# Altium project Dekor Natal.PrjPcb
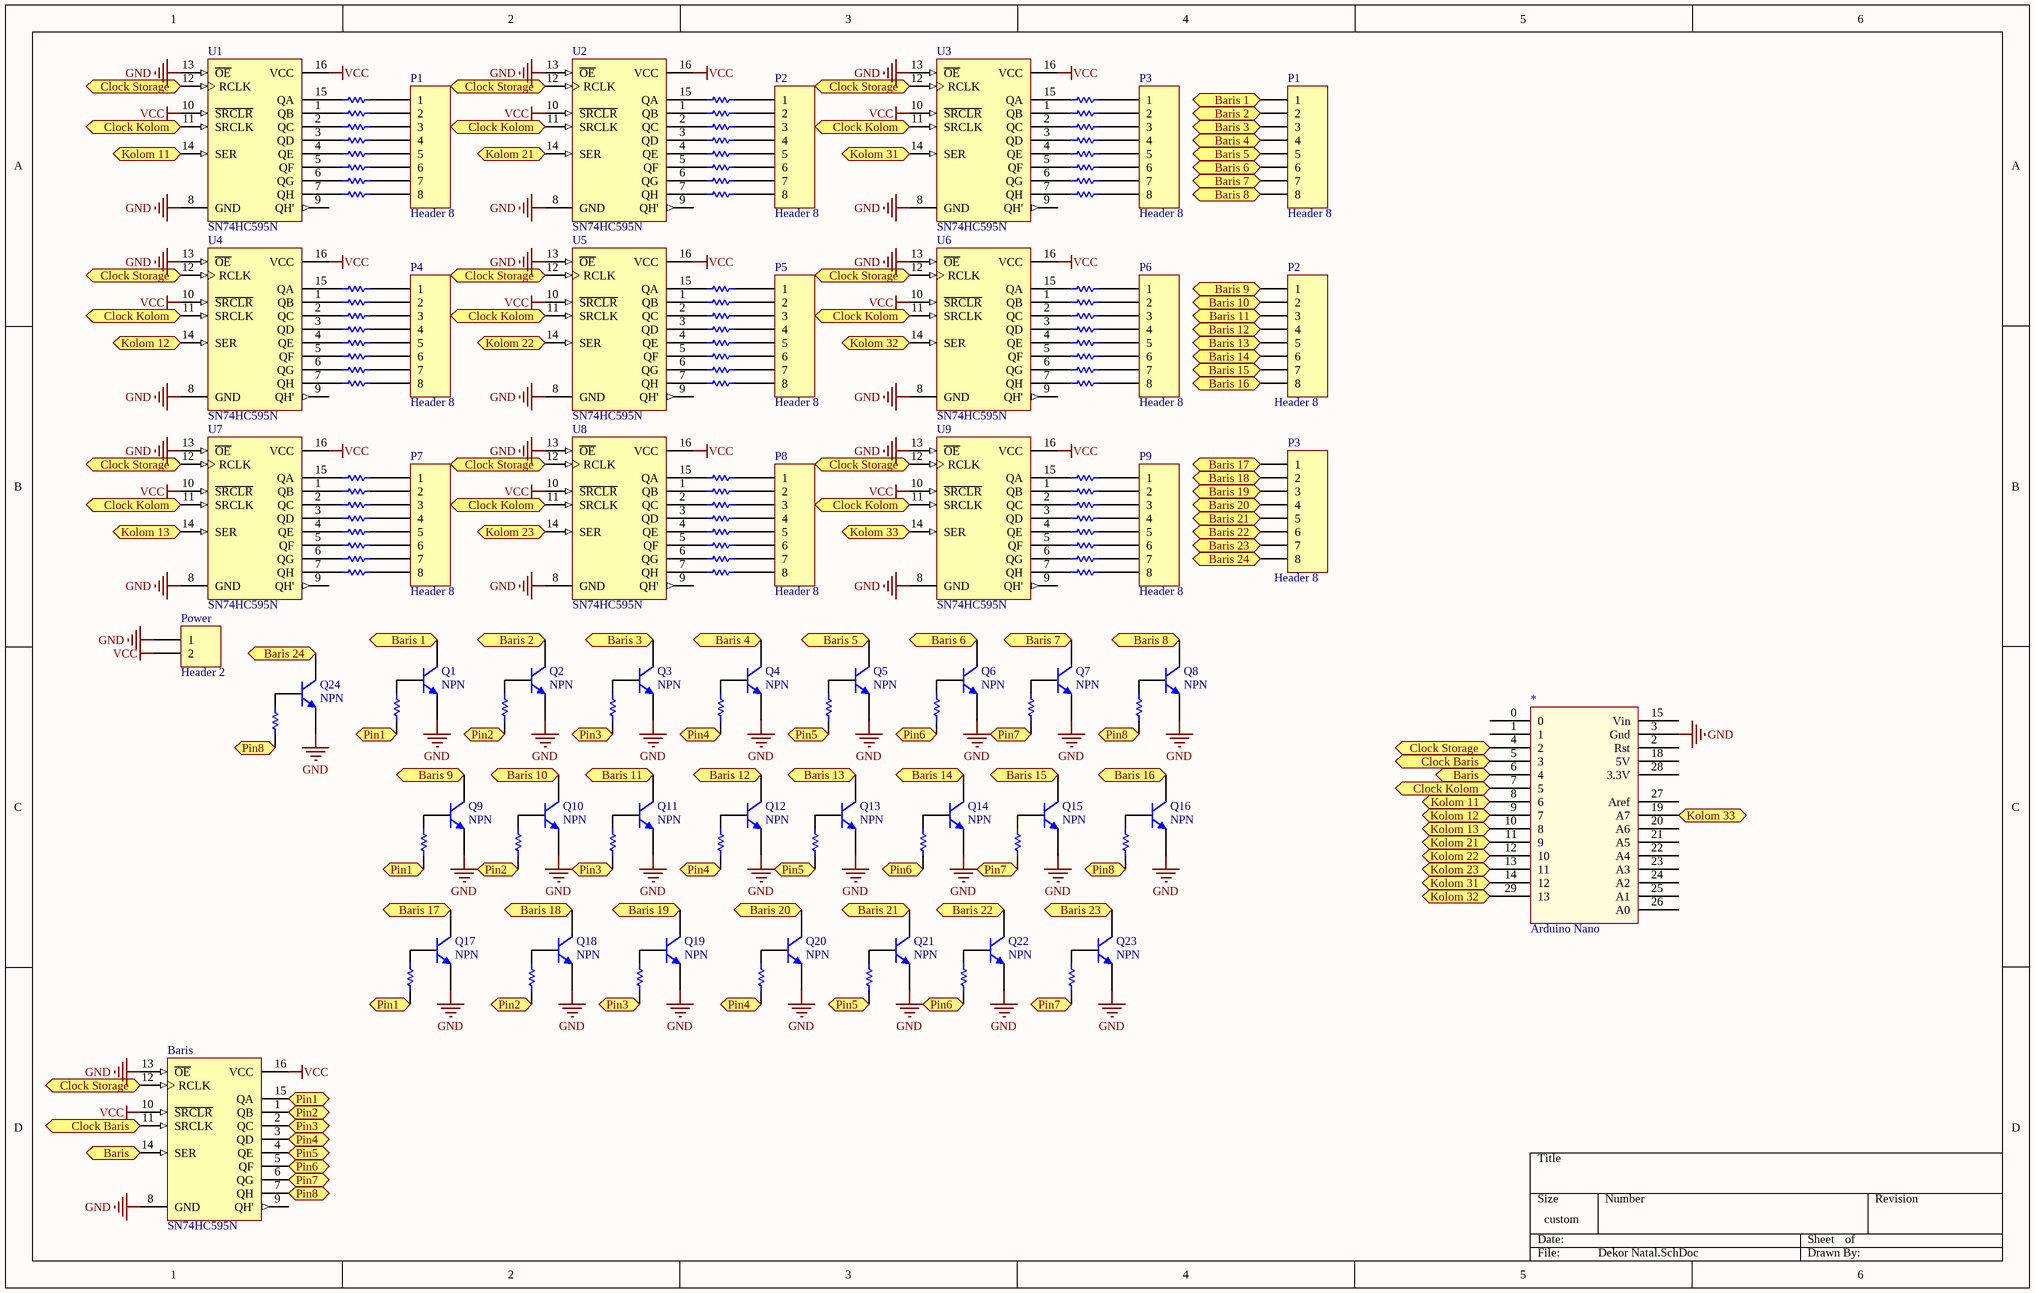
[diagram p0: Dekor Natal.SchDoc]
1 sheet, 144 parts. Net scope: flat (ports and power ports of the same name join across sheets).
Board file: Dekor Natal.PcbDoc

## Sheet Dekor Natal.SchDoc
size 381 x 241 mm; PageSetup: Record=PageOptions|CenterHorizontal=True|CenterVertical=True|PrintScale=1.00|XCorrection=1.00|YCorrection=1.00|PrintKind=1|BorderSize=5000000|LeftOffset=0|BottomOffset=0|Orientation=2|PaperLength=1000|PaperWidth=1000|Scale=100|PaperSource=7|PrintQuality=-4|MediaType=1|DitherType=10|PaperKind=A4 210x297mm|PrintScaleMode=1

### Parts
(Parts that share a designator on the sheet are numbered #1, #2 ... from top to bottom, then left to right.)
*  Arduino Nano  [Arduino Nano]
B1  Res0  [AXIAL-0.3]  (value not drawn)
B2  Res0  [AXIAL-0.3]  (value not drawn)
B3  Res0  [AXIAL-0.3]  (value not drawn)
B4  Res0  [AXIAL-0.3]  (value not drawn)
B5  Res0  [AXIAL-0.3]  (value not drawn)
B6  Res0  [AXIAL-0.3]  (value not drawn)
B7  Res0  [AXIAL-0.3]  (value not drawn)
B8  Res0  [AXIAL-0.3]  (value not drawn)
B9  Res0  [AXIAL-0.3]  (value not drawn)
B10  Res0  [AXIAL-0.3]  (value not drawn)
B11  Res0  [AXIAL-0.3]  (value not drawn)
B12  Res0  [AXIAL-0.3]  (value not drawn)
B13  Res0  [AXIAL-0.3]  (value not drawn)
B14  Res0  [AXIAL-0.3]  (value not drawn)
B15  Res0  [AXIAL-0.3]  (value not drawn)
B16  Res0  [AXIAL-0.3]  (value not drawn)
B17  Res0  [AXIAL-0.3]  (value not drawn)
B18  Res0  [AXIAL-0.3]  (value not drawn)
B19  Res0  [AXIAL-0.3]  (value not drawn)
B20  Res0  [AXIAL-0.3]  (value not drawn)
B21  Res0  [AXIAL-0.3]  (value not drawn)
B22  Res0  [AXIAL-0.3]  (value not drawn)
B23  Res0  [AXIAL-0.3]  (value not drawn)
B24  Res0  [AXIAL-0.3]  (value not drawn)
Baris  SN74HC595N  [N016]
P1#1  Header 8  [HDR1X8]
P1#2  Header 8  [HDR1X8]
P2#1  Header 8  [HDR1X8]
P2#2  Header 8  [HDR1X8]
P3#1  Header 8  [HDR1X8]
P3#2  Header 8  [HDR1X8]
P4  Header 8  [HDR1X8]
P5  Header 8  [HDR1X8]
P6  Header 8  [HDR1X8]
P7  Header 8  [HDR1X8]
P8  Header 8  [HDR1X8]
P9  Header 8  [HDR1X8]
Power  Header 2  [HDR1X2]
Q1  NPN  [TO-226-AA]
Q2  NPN  [TO-226-AA]
Q3  NPN  [TO-226-AA]
Q4  NPN  [TO-226-AA]
Q5  NPN  [TO-226-AA]
Q6  NPN  [TO-226-AA]
Q7  NPN  [TO-226-AA]
Q8  NPN  [TO-226-AA]
Q9  NPN  [TO-226-AA]
Q10  NPN  [TO-226-AA]
Q11  NPN  [TO-226-AA]
Q12  NPN  [TO-226-AA]
Q13  NPN  [TO-226-AA]
Q14  NPN  [TO-226-AA]
Q15  NPN  [TO-226-AA]
Q16  NPN  [TO-226-AA]
Q17  NPN  [TO-226-AA]
Q18  NPN  [TO-226-AA]
Q19  NPN  [TO-226-AA]
Q20  NPN  [TO-226-AA]
Q21  NPN  [TO-226-AA]
Q22  NPN  [TO-226-AA]
Q23  NPN  [TO-226-AA]
Q24  NPN  [TO-226-AA]
R11_1  Res0  [AXIAL-0.3]  (value not drawn)
R11_2  Res0  [AXIAL-0.3]  (value not drawn)
R11_3  Res0  [AXIAL-0.3]  (value not drawn)
R11_4  Res0  [AXIAL-0.3]  (value not drawn)
R11_5  Res0  [AXIAL-0.3]  (value not drawn)
R11_6  Res0  [AXIAL-0.3]  (value not drawn)
R11_7  Res0  [AXIAL-0.3]  (value not drawn)
R11_8  Res0  [AXIAL-0.3]  (value not drawn)
R12_1  Res0  [AXIAL-0.3]  (value not drawn)
R12_2  Res0  [AXIAL-0.3]  (value not drawn)
R12_3  Res0  [AXIAL-0.3]  (value not drawn)
R12_4  Res0  [AXIAL-0.3]  (value not drawn)
R12_5  Res0  [AXIAL-0.3]  (value not drawn)
R12_6  Res0  [AXIAL-0.3]  (value not drawn)
R12_7  Res0  [AXIAL-0.3]  (value not drawn)
R12_8  Res0  [AXIAL-0.3]  (value not drawn)
R13_1  Res0  [AXIAL-0.3]  (value not drawn)
R13_2  Res0  [AXIAL-0.3]  (value not drawn)
R13_3  Res0  [AXIAL-0.3]  (value not drawn)
R13_4  Res0  [AXIAL-0.3]  (value not drawn)
R13_5  Res0  [AXIAL-0.3]  (value not drawn)
R13_6  Res0  [AXIAL-0.3]  (value not drawn)
R13_7  Res0  [AXIAL-0.3]  (value not drawn)
R13_8  Res0  [AXIAL-0.3]  (value not drawn)
R21_1  Res0  [AXIAL-0.3]  (value not drawn)
R21_2  Res0  [AXIAL-0.3]  (value not drawn)
R21_3  Res0  [AXIAL-0.3]  (value not drawn)
R21_4  Res0  [AXIAL-0.3]  (value not drawn)
R21_5  Res0  [AXIAL-0.3]  (value not drawn)
R21_6  Res0  [AXIAL-0.3]  (value not drawn)
R21_7  Res0  [AXIAL-0.3]  (value not drawn)
R21_8  Res0  [AXIAL-0.3]  (value not drawn)
R22_1  Res0  [AXIAL-0.3]  (value not drawn)
R22_2  Res0  [AXIAL-0.3]  (value not drawn)
R22_3  Res0  [AXIAL-0.3]  (value not drawn)
R22_4  Res0  [AXIAL-0.3]  (value not drawn)
R22_5  Res0  [AXIAL-0.3]  (value not drawn)
R22_6  Res0  [AXIAL-0.3]  (value not drawn)
R22_7  Res0  [AXIAL-0.3]  (value not drawn)
R22_8  Res0  [AXIAL-0.3]  (value not drawn)
R23_1  Res0  [AXIAL-0.3]  (value not drawn)
R23_2  Res0  [AXIAL-0.3]  (value not drawn)
R23_3  Res0  [AXIAL-0.3]  (value not drawn)
R23_4  Res0  [AXIAL-0.3]  (value not drawn)
R23_5  Res0  [AXIAL-0.3]  (value not drawn)
R23_6  Res0  [AXIAL-0.3]  (value not drawn)
R23_7  Res0  [AXIAL-0.3]  (value not drawn)
R23_8  Res0  [AXIAL-0.3]  (value not drawn)
R31_1  Res0  [AXIAL-0.3]  (value not drawn)
R31_2  Res0  [AXIAL-0.3]  (value not drawn)
R31_3  Res0  [AXIAL-0.3]  (value not drawn)
R31_4  Res0  [AXIAL-0.3]  (value not drawn)
R31_5  Res0  [AXIAL-0.3]  (value not drawn)
R31_6  Res0  [AXIAL-0.3]  (value not drawn)
R31_7  Res0  [AXIAL-0.3]  (value not drawn)
R31_8  Res0  [AXIAL-0.3]  (value not drawn)
R32_1  Res0  [AXIAL-0.3]  (value not drawn)
R32_2  Res0  [AXIAL-0.3]  (value not drawn)
R32_3  Res0  [AXIAL-0.3]  (value not drawn)
R32_4  Res0  [AXIAL-0.3]  (value not drawn)
R32_5  Res0  [AXIAL-0.3]  (value not drawn)
R32_6  Res0  [AXIAL-0.3]  (value not drawn)
R32_7  Res0  [AXIAL-0.3]  (value not drawn)
R32_8  Res0  [AXIAL-0.3]  (value not drawn)
R33_1  Res0  [AXIAL-0.3]  (value not drawn)
R33_2  Res0  [AXIAL-0.3]  (value not drawn)
R33_3  Res0  [AXIAL-0.3]  (value not drawn)
R33_4  Res0  [AXIAL-0.3]  (value not drawn)
R33_5  Res0  [AXIAL-0.3]  (value not drawn)
R33_6  Res0  [AXIAL-0.3]  (value not drawn)
R33_7  Res0  [AXIAL-0.3]  (value not drawn)
R33_8  Res0  [AXIAL-0.3]  (value not drawn)
U1  SN74HC595N  [N016]
U2  SN74HC595N  [N016]
U3  SN74HC595N  [N016]
U4  SN74HC595N  [N016]
U5  SN74HC595N  [N016]
U6  SN74HC595N  [N016]
U7  SN74HC595N  [N016]
U8  SN74HC595N  [N016]
U9  SN74HC595N  [N016]

### Ports
Baris, Baris 1, Baris 2, Baris 3, Baris 4, Baris 5, Baris 6, Baris 7, Baris 8, Baris 9, Baris 10, Baris 11, Baris 12, Baris 13, Baris 14, Baris 15, Baris 16, Baris 17, Baris 18, Baris 19, Baris 20, Baris 21, Baris 22, Baris 23, Baris 24, Clock Baris, Clock Kolom, Clock Storage, Kolom 11, Kolom 12, Kolom 13, Kolom 21, Kolom 22, Kolom 23, Kolom 31, Kolom 32, Kolom 33, Pin1, Pin2, Pin3, Pin4, Pin5, Pin6, Pin7, Pin8

### Nets
GND: *.3(Gnd) Baris.8(GND) Baris.13(~{OE}) Power.1 Q1.3(E) Q2.3(E) Q3.3(E) Q4.3(E) Q5.3(E) Q6.3(E) Q7.3(E) Q8.3(E) Q9.3(E) Q10.3(E) Q11.3(E) Q12.3(E) Q13.3(E) Q14.3(E) Q15.3(E) Q16.3(E) Q17.3(E) Q18.3(E) Q19.3(E) Q20.3(E) Q21.3(E) Q22.3(E) Q23.3(E) Q24.3(E) U1.8(GND) U1.13(~{OE}) U2.8(GND) U2.13(~{OE}) U3.8(GND) U3.13(~{OE}) U4.8(GND) U4.13(~{OE}) U5.8(GND) U5.13(~{OE}) U6.8(GND) U6.13(~{OE}) U7.8(GND) U7.13(~{OE}) U8.8(GND) U8.13(~{OE}) U9.8(GND) U9.13(~{OE})
VCC: Baris.10(~{SRCLR}) Baris.16(VCC) Power.2 U1.10(~{SRCLR}) U1.16(VCC) U2.10(~{SRCLR}) U2.16(VCC) U3.10(~{SRCLR}) U3.16(VCC) U4.10(~{SRCLR}) U4.16(VCC) U5.10(~{SRCLR}) U5.16(VCC) U6.10(~{SRCLR}) U6.16(VCC) U7.10(~{SRCLR}) U7.16(VCC) U8.10(~{SRCLR}) U8.16(VCC) U9.10(~{SRCLR}) U9.16(VCC)
Net*_4: *.4(2) Baris.12(RCLK) U1.12(RCLK) U2.12(RCLK) U3.12(RCLK) U4.12(RCLK) U5.12(RCLK) U6.12(RCLK) U7.12(RCLK) U8.12(RCLK) U9.12(RCLK) ; port Clock Storage
Net*_5: *.5(3) Baris.11(SRCLK) ; port Clock Baris
Net*_6: *.6(4) Baris.14(SER) ; port Baris
Net*_7: *.7(5) U1.11(SRCLK) U2.11(SRCLK) U3.11(SRCLK) U4.11(SRCLK) U5.11(SRCLK) U6.11(SRCLK) U7.11(SRCLK) U8.11(SRCLK) U9.11(SRCLK) ; port Clock Kolom
Net*_8: *.8(6) U1.14(SER) ; port Kolom 11
Net*_9: *.9(7) U4.14(SER) ; port Kolom 12
Net*_10: *.10(8) U7.14(SER) ; port Kolom 13
Net*_11: *.11(9) U2.14(SER) ; port Kolom 21
Net*_12: *.12(10) U5.14(SER) ; port Kolom 22
Net*_13: *.13(11) U8.14(SER) ; port Kolom 23
Net*_14: *.14(12) U3.14(SER) ; port Kolom 31
Net*_19: *.19(A7) U9.14(SER) ; port Kolom 33
Net*_29: *.29(13) U6.14(SER) ; port Kolom 32
NetB1_1: B1.1 B9.1 B17.1 Baris.15(QA) ; port Pin1
NetB1_2: B1.2 Q1.2(B)
NetB2_1: B2.1 B10.1 B18.1 Baris.1(QB) ; port Pin2
NetB2_2: B2.2 Q2.2(B)
NetB3_1: B3.1 B11.1 B19.1 Baris.2(QC) ; port Pin3
NetB3_2: B3.2 Q3.2(B)
NetB4_1: B4.1 B12.1 B20.1 Baris.3(QD) ; port Pin4
NetB4_2: B4.2 Q4.2(B)
NetB5_1: B5.1 B13.1 B21.1 Baris.4(QE) ; port Pin5
NetB5_2: B5.2 Q5.2(B)
NetB6_1: B6.1 B14.1 B22.1 Baris.5(QF) ; port Pin6
NetB6_2: B6.2 Q6.2(B)
NetB7_1: B7.1 B15.1 B23.1 Baris.6(QG) ; port Pin7
NetB7_2: B7.2 Q7.2(B)
NetB8_1: B8.1 B16.1 B24.1 Baris.7(QH) ; port Pin8
NetB8_2: B8.2 Q8.2(B)
NetB9_2: B9.2 Q9.2(B)
NetB10_2: B10.2 Q10.2(B)
NetB11_2: B11.2 Q11.2(B)
NetB12_2: B12.2 Q12.2(B)
NetB13_2: B13.2 Q13.2(B)
NetB14_2: B14.2 Q14.2(B)
NetB15_2: B15.2 Q15.2(B)
NetB16_2: B16.2 Q16.2(B)
NetB17_2: B17.2 Q17.2(B)
NetB18_2: B18.2 Q18.2(B)
NetB19_2: B19.2 Q19.2(B)
NetB20_2: B20.2 Q20.2(B)
NetB21_2: B21.2 Q21.2(B)
NetB22_2: B22.2 Q22.2(B)
NetB23_2: B23.2 Q23.2(B)
NetB24_2: B24.2 Q24.2(B)
NetP1#1_1: P1#1.1 R11_1.2
NetP1#1_2: P1#1.2 R11_2.2
NetP1#1_3: P1#1.3 R11_3.2
NetP1#1_4: P1#1.4 R11_4.2
NetP1#1_5: P1#1.5 R11_5.2
NetP1#1_6: P1#1.6 R11_6.2
NetP1#1_7: P1#1.7 R11_7.2
NetP1#1_8: P1#1.8 R11_8.2
NetP1#2_1: P1#2.1 Q1.1(C) ; port Baris 1
NetP1#2_2: P1#2.2 Q2.1(C) ; port Baris 2
NetP1#2_3: P1#2.3 Q3.1(C) ; port Baris 3
NetP1#2_4: P1#2.4 Q4.1(C) ; port Baris 4
NetP1#2_5: P1#2.5 Q5.1(C) ; port Baris 5
NetP1#2_6: P1#2.6 Q6.1(C) ; port Baris 6
NetP1#2_7: P1#2.7 Q7.1(C) ; port Baris 7
NetP1#2_8: P1#2.8 Q8.1(C) ; port Baris 8
NetP2#1_1: P2#1.1 R21_1.2
NetP2#1_2: P2#1.2 R21_2.2
NetP2#1_3: P2#1.3 R21_3.2
NetP2#1_4: P2#1.4 R21_4.2
NetP2#1_5: P2#1.5 R21_5.2
NetP2#1_6: P2#1.6 R21_6.2
NetP2#1_7: P2#1.7 R21_7.2
NetP2#1_8: P2#1.8 R21_8.2
NetP2#2_1: P2#2.1 Q9.1(C) ; port Baris 9
NetP2#2_2: P2#2.2 Q10.1(C) ; port Baris 10
NetP2#2_3: P2#2.3 Q11.1(C) ; port Baris 11
NetP2#2_4: P2#2.4 Q12.1(C) ; port Baris 12
NetP2#2_5: P2#2.5 Q13.1(C) ; port Baris 13
NetP2#2_6: P2#2.6 Q14.1(C) ; port Baris 14
NetP2#2_7: P2#2.7 Q15.1(C) ; port Baris 15
NetP2#2_8: P2#2.8 Q16.1(C) ; port Baris 16
NetP3#1_1: P3#1.1 R31_1.2
NetP3#1_2: P3#1.2 R31_2.2
NetP3#1_3: P3#1.3 R31_3.2
NetP3#1_4: P3#1.4 R31_4.2
NetP3#1_5: P3#1.5 R31_5.2
NetP3#1_6: P3#1.6 R31_6.2
NetP3#1_7: P3#1.7 R31_7.2
NetP3#1_8: P3#1.8 R31_8.2
NetP3#2_1: P3#2.1 Q17.1(C) ; port Baris 17
NetP3#2_2: P3#2.2 Q18.1(C) ; port Baris 18
NetP3#2_3: P3#2.3 Q19.1(C) ; port Baris 19
NetP3#2_4: P3#2.4 Q20.1(C) ; port Baris 20
NetP3#2_5: P3#2.5 Q21.1(C) ; port Baris 21
NetP3#2_6: P3#2.6 Q22.1(C) ; port Baris 22
NetP3#2_7: P3#2.7 Q23.1(C) ; port Baris 23
NetP3#2_8: P3#2.8 Q24.1(C) ; port Baris 24
NetP4_1: P4.1 R12_1.2
NetP4_2: P4.2 R12_2.2
NetP4_3: P4.3 R12_3.2
NetP4_4: P4.4 R12_4.2
NetP4_5: P4.5 R12_5.2
NetP4_6: P4.6 R12_6.2
NetP4_7: P4.7 R12_7.2
NetP4_8: P4.8 R12_8.2
NetP5_1: P5.1 R22_1.2
NetP5_2: P5.2 R22_2.2
NetP5_3: P5.3 R22_3.2
NetP5_4: P5.4 R22_4.2
NetP5_5: P5.5 R22_5.2
NetP5_6: P5.6 R22_6.2
NetP5_7: P5.7 R22_7.2
NetP5_8: P5.8 R22_8.2
NetP6_1: P6.1 R32_1.2
NetP6_2: P6.2 R32_2.2
NetP6_3: P6.3 R32_3.2
NetP6_4: P6.4 R32_4.2
NetP6_5: P6.5 R32_5.2
NetP6_6: P6.6 R32_6.2
NetP6_7: P6.7 R32_7.2
NetP6_8: P6.8 R32_8.2
NetP7_1: P7.1 R13_1.2
NetP7_2: P7.2 R13_2.2
NetP7_3: P7.3 R13_3.2
NetP7_4: P7.4 R13_4.2
NetP7_5: P7.5 R13_5.2
NetP7_6: P7.6 R13_6.2
NetP7_7: P7.7 R13_7.2
NetP7_8: P7.8 R13_8.2
NetP8_1: P8.1 R23_1.2
NetP8_2: P8.2 R23_2.2
NetP8_3: P8.3 R23_3.2
NetP8_4: P8.4 R23_4.2
NetP8_5: P8.5 R23_5.2
NetP8_6: P8.6 R23_6.2
NetP8_7: P8.7 R23_7.2
NetP8_8: P8.8 R23_8.2
NetP9_1: P9.1 R33_1.2
NetP9_2: P9.2 R33_2.2
NetP9_3: P9.3 R33_3.2
NetP9_4: P9.4 R33_4.2
NetP9_5: P9.5 R33_5.2
NetP9_6: P9.6 R33_6.2
NetP9_7: P9.7 R33_7.2
NetP9_8: P9.8 R33_8.2
NetR11_1_1: R11_1.1 U1.15(QA)
NetR11_2_1: R11_2.1 U1.1(QB)
NetR11_3_1: R11_3.1 U1.2(QC)
NetR11_4_1: R11_4.1 U1.3(QD)
NetR11_5_1: R11_5.1 U1.4(QE)
NetR11_6_1: R11_6.1 U1.5(QF)
NetR11_7_1: R11_7.1 U1.6(QG)
NetR11_8_1: R11_8.1 U1.7(QH)
NetR12_1_1: R12_1.1 U4.15(QA)
NetR12_2_1: R12_2.1 U4.1(QB)
NetR12_3_1: R12_3.1 U4.2(QC)
NetR12_4_1: R12_4.1 U4.3(QD)
NetR12_5_1: R12_5.1 U4.4(QE)
NetR12_6_1: R12_6.1 U4.5(QF)
NetR12_7_1: R12_7.1 U4.6(QG)
NetR12_8_1: R12_8.1 U4.7(QH)
NetR13_1_1: R13_1.1 U7.15(QA)
NetR13_2_1: R13_2.1 U7.1(QB)
NetR13_3_1: R13_3.1 U7.2(QC)
NetR13_4_1: R13_4.1 U7.3(QD)
NetR13_5_1: R13_5.1 U7.4(QE)
NetR13_6_1: R13_6.1 U7.5(QF)
NetR13_7_1: R13_7.1 U7.6(QG)
NetR13_8_1: R13_8.1 U7.7(QH)
NetR21_1_1: R21_1.1 U2.15(QA)
NetR21_2_1: R21_2.1 U2.1(QB)
NetR21_3_1: R21_3.1 U2.2(QC)
NetR21_4_1: R21_4.1 U2.3(QD)
NetR21_5_1: R21_5.1 U2.4(QE)
NetR21_6_1: R21_6.1 U2.5(QF)
NetR21_7_1: R21_7.1 U2.6(QG)
NetR21_8_1: R21_8.1 U2.7(QH)
NetR22_1_1: R22_1.1 U5.15(QA)
NetR22_2_1: R22_2.1 U5.1(QB)
NetR22_3_1: R22_3.1 U5.2(QC)
NetR22_4_1: R22_4.1 U5.3(QD)
NetR22_5_1: R22_5.1 U5.4(QE)
NetR22_6_1: R22_6.1 U5.5(QF)
NetR22_7_1: R22_7.1 U5.6(QG)
NetR22_8_1: R22_8.1 U5.7(QH)
NetR23_1_1: R23_1.1 U8.15(QA)
NetR23_2_1: R23_2.1 U8.1(QB)
NetR23_3_1: R23_3.1 U8.2(QC)
NetR23_4_1: R23_4.1 U8.3(QD)
NetR23_5_1: R23_5.1 U8.4(QE)
NetR23_6_1: R23_6.1 U8.5(QF)
NetR23_7_1: R23_7.1 U8.6(QG)
NetR23_8_1: R23_8.1 U8.7(QH)
NetR31_1_1: R31_1.1 U3.15(QA)
NetR31_2_1: R31_2.1 U3.1(QB)
NetR31_3_1: R31_3.1 U3.2(QC)
NetR31_4_1: R31_4.1 U3.3(QD)
NetR31_5_1: R31_5.1 U3.4(QE)
NetR31_6_1: R31_6.1 U3.5(QF)
NetR31_7_1: R31_7.1 U3.6(QG)
NetR31_8_1: R31_8.1 U3.7(QH)
NetR32_1_1: R32_1.1 U6.15(QA)
NetR32_2_1: R32_2.1 U6.1(QB)
NetR32_3_1: R32_3.1 U6.2(QC)
NetR32_4_1: R32_4.1 U6.3(QD)
NetR32_5_1: R32_5.1 U6.4(QE)
NetR32_6_1: R32_6.1 U6.5(QF)
NetR32_7_1: R32_7.1 U6.6(QG)
NetR32_8_1: R32_8.1 U6.7(QH)
NetR33_1_1: R33_1.1 U9.15(QA)
NetR33_2_1: R33_2.1 U9.1(QB)
NetR33_3_1: R33_3.1 U9.2(QC)
NetR33_4_1: R33_4.1 U9.3(QD)
NetR33_5_1: R33_5.1 U9.4(QE)
NetR33_6_1: R33_6.1 U9.5(QF)
NetR33_7_1: R33_7.1 U9.6(QG)
NetR33_8_1: R33_8.1 U9.7(QH)

Not connected (* = marked no-connect by the designer): * 0 1 2(Rst) 15(Vin) 18(5V) 20(A6) 21(A5) 22(A4) 23(A3) 24(A2) 25(A1) 26(A0) 27(Aref) 28(3.3V); Baris 9(QH'); U1 9(QH'); U2 9(QH'); U3 9(QH'); U4 9(QH'); U5 9(QH'); U6 9(QH'); U7 9(QH'); U8 9(QH'); U9 9(QH')

### Library data of the parts
B1-B24 R11_1-R11_8 R12_1-R12_8 R13_1-R13_8 R21_1-R21_8 R22_1-R22_8 R23_1-R23_8 R31_1-R31_8 R32_1-R32_8 R33_1-R33_8 = Res1: Resistor; Published: 8-Jun-2000; LatestRevisionDate: 17-Jul-2002; LatestRevisionNote: Re-released for DXP Platform.; PackageReference: AXIAL-0.3; Publisher: Altium Limited; PackageDescription: Axial Device, Thru-Hole; 2 Leads; 0.3 in Pin Spacing
Baris U1-U9 = SN74HC595N: 8-Bit Shift Register with 3-State Output Registers; Published: 8-Jun-2000; LatestRevisionDate: 04-Mar-2005; LatestRevisionNote: Stylized 3D Model Added.; DatasheetVersion: May-1997; PackageVersion: Oct-1995; PackageReference: N016; Publisher: Altium Limited; PackageDescription: DIP; 16 Leads; Row Spacing 7.62 mm; Pitch 2.54 mm; Code_JEDEC: MS-001-BB; ComponentLink1Description: Manufacturer Link; ComponentLink1URL: http://www.ti.com/; ComponentLink2Description: Datasheet; ComponentLink2URL: http://www-s.ti.com/sc/ds/sn74hc595.pdf
P1#1 P1#2 P2#1 P2#2 P3#1 P3#2 P4-P9 = Header 8: Header, 8-Pin; LatestRevisionDate: 17-Jul-2002; LatestRevisionNote: Re-released for DXP Platform.; Publisher: Altium Limited
Power = Header 2: Header, 2-Pin; LatestRevisionDate: 17-Jul-2002; LatestRevisionNote: Re-released for DXP Platform.; Publisher: Altium Limited
Q1-Q24 = NPN: NPN Bipolar Transistor; Published: 8-Jun-2000; LatestRevisionDate: 17-Jul-2002; LatestRevisionNote: Re-released for DXP Platform.; PackageReference: TO-226-AA; Publisher: Altium Limited; PackageDescription: TO, Flat Index; 3 In-Line, Axial Leads; Body Dia. 4.8mm; Leads 0.55 x 0.51 mm (max); Code_JEDEC: TO-226-AA